# EAGLE design expansion-dualdrive (EAGLE 9.6.2)
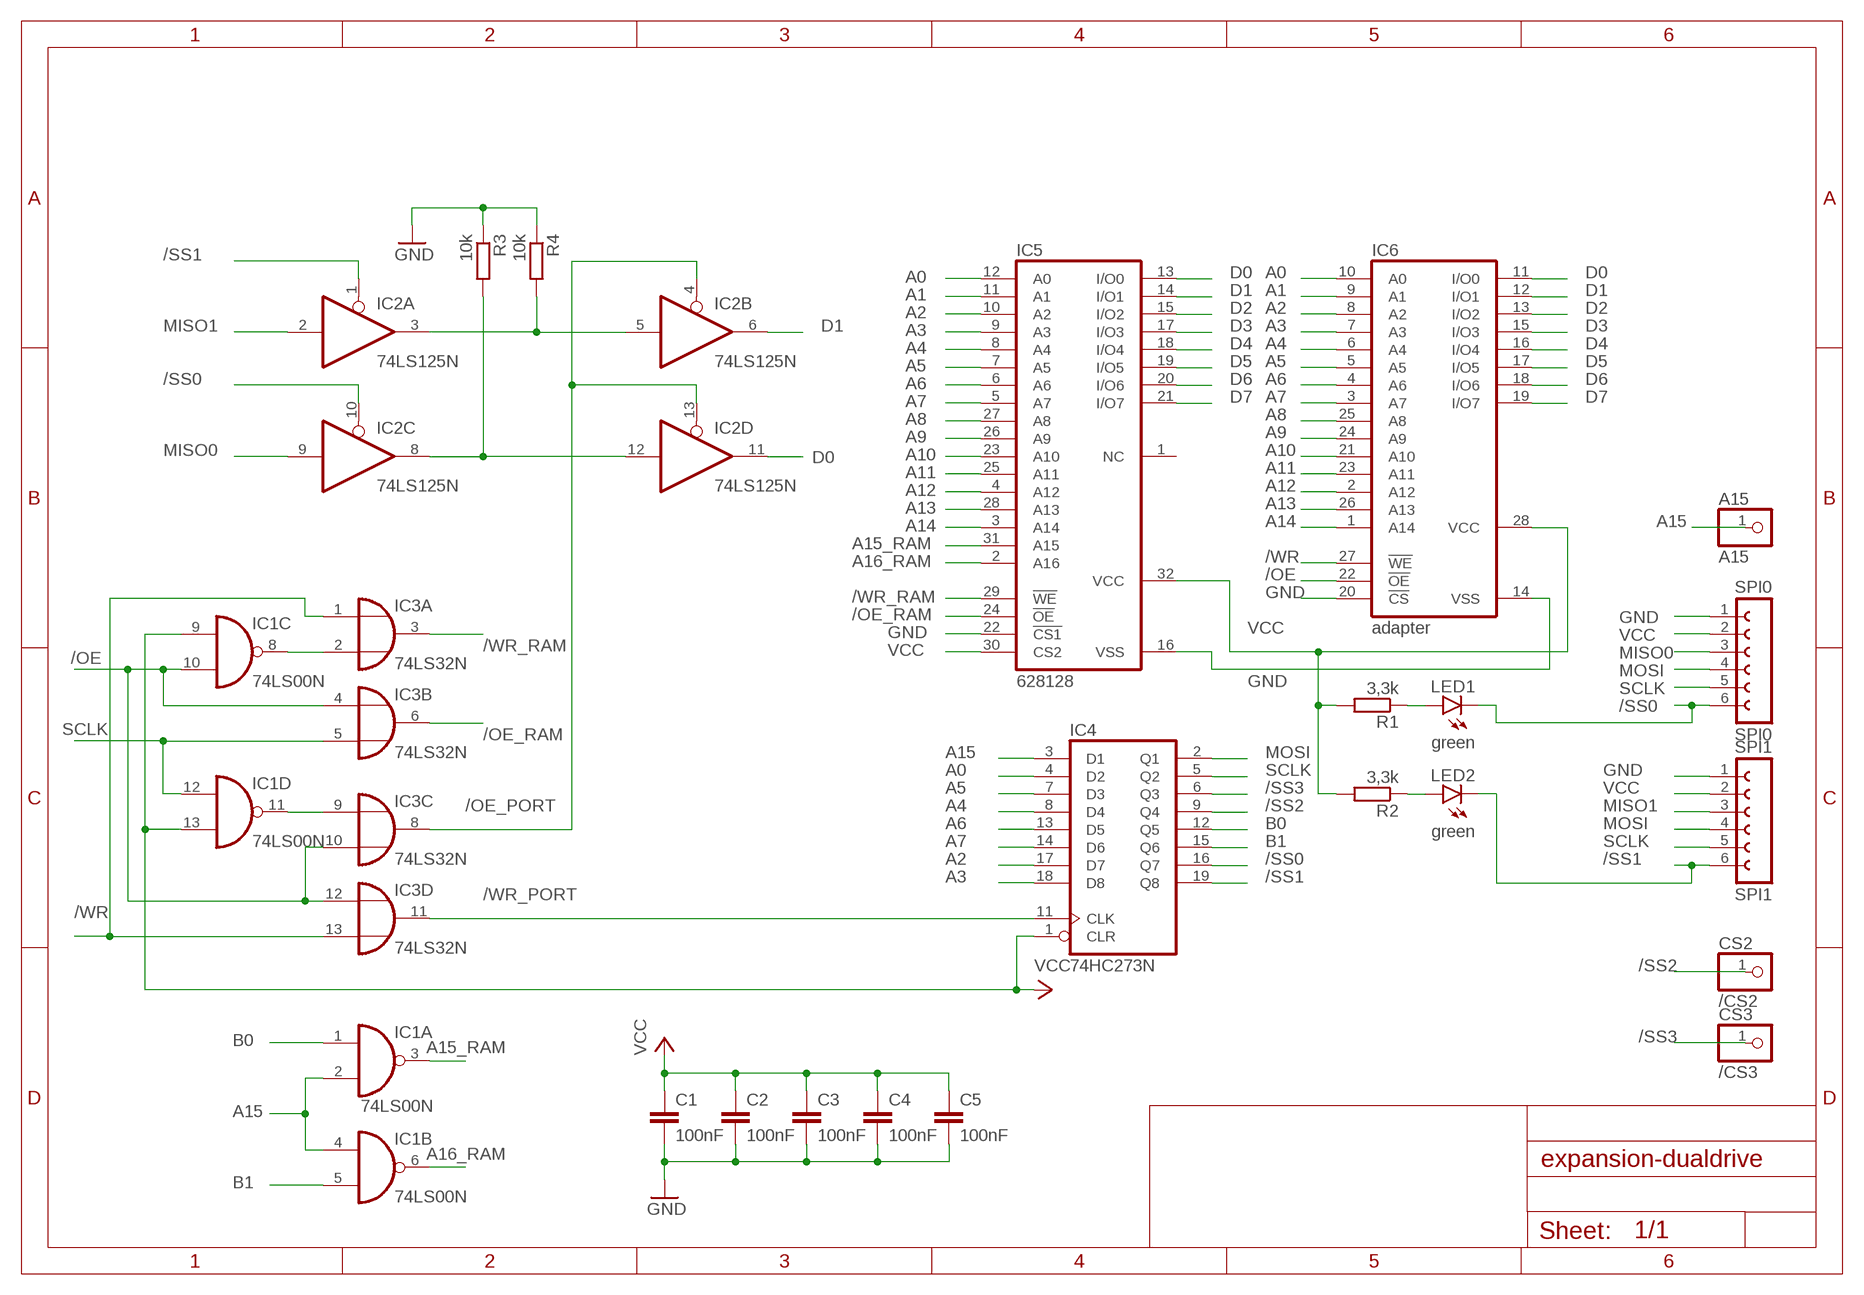
[diagram p0: schematic, sheet 1]

## Parts
A15  A15  PINHD-1X1  [1X01]
C1  100nF  C-EU050-024X044  [C050-024X044]
C2  100nF  C-EU050-024X044  [C050-024X044]
C3  100nF  C-EU050-024X044  [C050-024X044]
C4  100nF  C-EU050-024X044  [C050-024X044]
C5  100nF  C-EU050-024X044  [C050-024X044]
CS2  /CS2  PINHD-1X1  [1X01]
CS3  /CS3  PINHD-1X1  [1X01]
IC1  74LS00N  [DIL14]
IC2  74LS125N  [DIL14]
IC3  74LS32N  [DIL14]
IC4  74HC273N  [DIL20]
IC5  628128  628128P  [DIL32]
IC6  adapter  62256P  [DIL28-6]
LED1  green  LED3MM  [LED3MM]
LED2  green  LED3MM  [LED3MM]
R1  3,3k  R-EU_0207/10  [0207/10]
R2  3,3k  R-EU_0207/10  [0207/10]
R3  10k  R-EU_0207/10  [0207/10]
R4  10k  R-EU_0207/10  [0207/10]
SPI0  SPI0  FE06-1  [FE06]
SPI1  SPI1  FE06-1  [FE06]

## Nets
/OE: IC1.10(C:I1) IC3.4(B:I0) IC3.10(C:I1) IC3.12(D:I0) IC6.22(!OE)
/OE_PORT: IC2.4(B:OE) IC2.13(D:OE) IC3.8(C:O)
/OE_RAM: IC3.6(B:O) IC5.24(!OE)
/SS0: IC2.10(C:OE) IC4.16(Q7) LED1.K(C) SPI0.6
/SS1: IC2.1(A:OE) IC4.19(Q8) LED2.K(C) SPI1.6
/SS2: CS2.1 IC4.9(Q4)
/SS3: CS3.1 IC4.6(Q3)
/WR: IC3.1(A:I0) IC3.13(D:I1) IC6.27(!WE)
/WR_PORT: IC3.11(D:O) IC4.11(CLK)
/WR_RAM: IC3.3(A:O) IC5.29(!WE)
A0: IC4.4(D2) IC5.12(A0) IC6.10(A0)
A1: IC5.11(A1) IC6.9(A1)
A2: IC4.17(D7) IC5.10(A2) IC6.8(A2)
A3: IC4.18(D8) IC5.9(A3) IC6.7(A3)
A4: IC4.8(D4) IC5.8(A4) IC6.6(A4)
A5: IC4.7(D3) IC5.7(A5) IC6.5(A5)
A6: IC4.13(D5) IC5.6(A6) IC6.4(A6)
A7: IC4.14(D6) IC5.5(A7) IC6.3(A7)
A8: IC5.27(A8) IC6.25(A8)
A9: IC5.26(A9) IC6.24(A9)
A10: IC5.23(A10) IC6.21(A10)
A11: IC5.25(A11) IC6.23(A11)
A12: IC5.4(A12) IC6.2(A12)
A13: IC5.28(A13) IC6.26(A13)
A14: IC5.3(A14) IC6.1(A14)
A15: A15.1 IC1.2(A:I1) IC1.4(B:I0) IC4.3(D1)
A15_RAM: IC1.3(A:O) IC5.31(A15)
A16_RAM: IC1.6(B:O) IC5.2(A16)
B0: IC1.1(A:I0) IC4.12(Q5)
B1: IC1.5(B:I1) IC4.15(Q6)
D0: IC2.11(D:O) IC5.13(I/O0) IC6.11(I/O0)
D1: IC2.6(B:O) IC5.14(I/O1) IC6.12(I/O1)
D2: IC5.15(I/O2) IC6.13(I/O2)
D3: IC5.17(I/O3) IC6.15(I/O3)
D4: IC5.18(I/O4) IC6.16(I/O4)
D5: IC5.19(I/O5) IC6.17(I/O5)
D6: IC5.20(I/O6) IC6.18(I/O6)
D7: IC5.21(I/O7) IC6.19(I/O7)
GND [power]: C1.2 C2.2 C3.2 C4.2 C5.2 IC5.16(VSS) IC5.22(!CS1) IC6.14(VSS) IC6.20(!CS) R3.1 R4.1 SPI0.1 SPI1.1
MI0: IC2.8(C:O) IC2.12(D:I) R3.2
MI1: IC2.3(A:O) IC2.5(B:I) R4.2
MISO0: IC2.9(C:I) SPI0.3
MISO1: IC2.2(A:I) SPI1.3
MOSI: IC4.2(Q1) SPI0.4 SPI1.4
N$1: IC1.8(C:O) IC3.2(A:I1)
N$2: LED1.A R1.1
N$3: IC1.11(D:O) IC3.9(C:I0)
N$4: LED2.A R2.1
SCLK: IC1.12(D:I0) IC3.5(B:I1) IC4.5(Q2) SPI0.5 SPI1.5
VCC [power]: C1.1 C2.1 C3.1 C4.1 C5.1 IC1.9(C:I0) IC1.13(D:I1) IC4.1(CLR) IC5.30(CS2) IC5.32(VCC) IC6.28(VCC) R1.2 R2.2 SPI0.2 SPI1.2
Unconnected: IC5.1(NC)

## Power pins joined to a net without a drawn wire
GND: IC1.7(P:GND) IC2.7(P:GND) IC3.7(P:GND) IC4.10(GND)
VCC: IC1.14(P:VCC) IC2.14(P:VCC) IC3.14(P:VCC) IC4.20(VCC)

## Library data of the parts
A15 CS2 CS3 = pinhead:PINHD-1X1: PIN HEADER
C1-C5 = rcl:C-EU: CAPACITOR, European symbol; SPICEPREFIX: C
IC1 = 74xx-eu:74*00: Quad 2-input NAND gate
IC2 = 74xx-eu:74*125: Quad bus BUFFER, 3-state
IC3 = 74xx-eu:74*32: Quad 2-input OR gate
IC4 = 74xx-eu:74*273: Octal D type FLIP FLOP, clear
IC5 = memory-hitachi:628128P: MEMORY; OC_FARNELL: unknown; OC_NEWARK: unknown
IC6 = memory-hitachi:62256P: MEMORY; OC_FARNELL: unknown; OC_NEWARK: unknown
LED1 LED2 = led:LED: LED OSRAM: - CHIPLED LG R971, LG N971, LY N971, LG Q971, LY Q971, LO R971, LY R971 LH N974, LH R974 LS Q976, LO Q976, LY Q976 LO Q996 - Hyper CHIPLED LW Q18S LB Q993, LB Q99A, LB R99A - SideLED LS A670, LO A670, LY A670, LG A670, LP A670 LB A673, LV A673, LT A673, LW A673 LH A674 LY A675 LS A676, LA A676, LO A676, LY A676, LW A676 LS A679, LY A679, LG A679 - Hyper Micro SIDELED® LS Y876, LA Y876, LO Y876, LY Y876 LT Y87S - SmartLED LW L88C, LW L88S LB L89C, LB L89S, LG L890 LS L89K, LO L89K, LY L89K LS L896, LA L896, LO L896, LY L896 - TOPLED LS T670, LO T670, LY T670, LG T670, LP T670 LSG T670, LSP T670, LSY T670, LOP T670, LYG T670 LG T671, LOG T671, LSG T671 LB T673, LV T673, LT T673, LW T673 LH T674 LS T676, LA T676, LO T676, LY T676, LB T676, LH T676, LSB T676, LW T676 LB T67C, LV T67C, LT T67C, LS T67K, LO T67K, LY T67K, LW E67C LS E67B, LA E67B, LO E67B, LY E67B, LB E67C, LV E67C, LT E67C LW T67C LS T679, LY T679, LG T679 LS T770, LO T770, LY T770, LG T770, LP T770 LB T773, LV T773, LT T773, LW T773 LH T774 LS E675, LA E675, LY E675, LS T675 LS T776, LA T776, LO T776, LY T776, LB T776 LHGB T686 LT T68C, LB T68C - Hyper Mini TOPLED® LB M676 - Mini TOPLED Santana® LG M470 LS M47K, LO M47K, LY M47K Source: http://www.osram.convergy.de LUXEON: - LUMILED® LXK2-PW12-R00, LXK2-PW12-S00, LXK2-PW14-U00, LXK2-PW14-V00 LXK2-PM12-R00, LXK2-PM12-S00, LXK2-PM14-U00 LXK2-PE12-Q00, LXK2-PE12-R00, LXK2-PE12-S00, LXK2-PE14-T00, LXK2-PE14-U00 LXK2-PB12-K00, LXK2-PB12-L00, LXK2-PB12-M00, LXK2-PB14-N00, LXK2-PB14-P00, LXK2-PB14-Q00 LXK2-PR12-L00, LXK2-PR12-M00, LXK2-PR14-Q00, LXK2-PR14-R00 LXK2-PD12-Q00, LXK2-PD12-R00, LXK2-PD12-S00 LXK2-PH12-R00, LXK2-PH12-S00 LXK2-PL12-P00, LXK2-PL12-Q00, LXK2-PL12-R00 Source: www.luxeon.com KINGBRIGHT: KA-3528ASYC Source: www.kingbright.com
R1-R4 = rcl:R-EU_: RESISTOR, European symbol; SPICEPREFIX: R
SPI0 SPI1 = con-lsta:FE06-1: FEMALE HEADER; OC_FARNELL: unknown; OC_NEWARK: unknown

## Net classes
0 default: width 0.305 mm
1 power: width 0.508 mm, clearance 0.203 mm

## Board
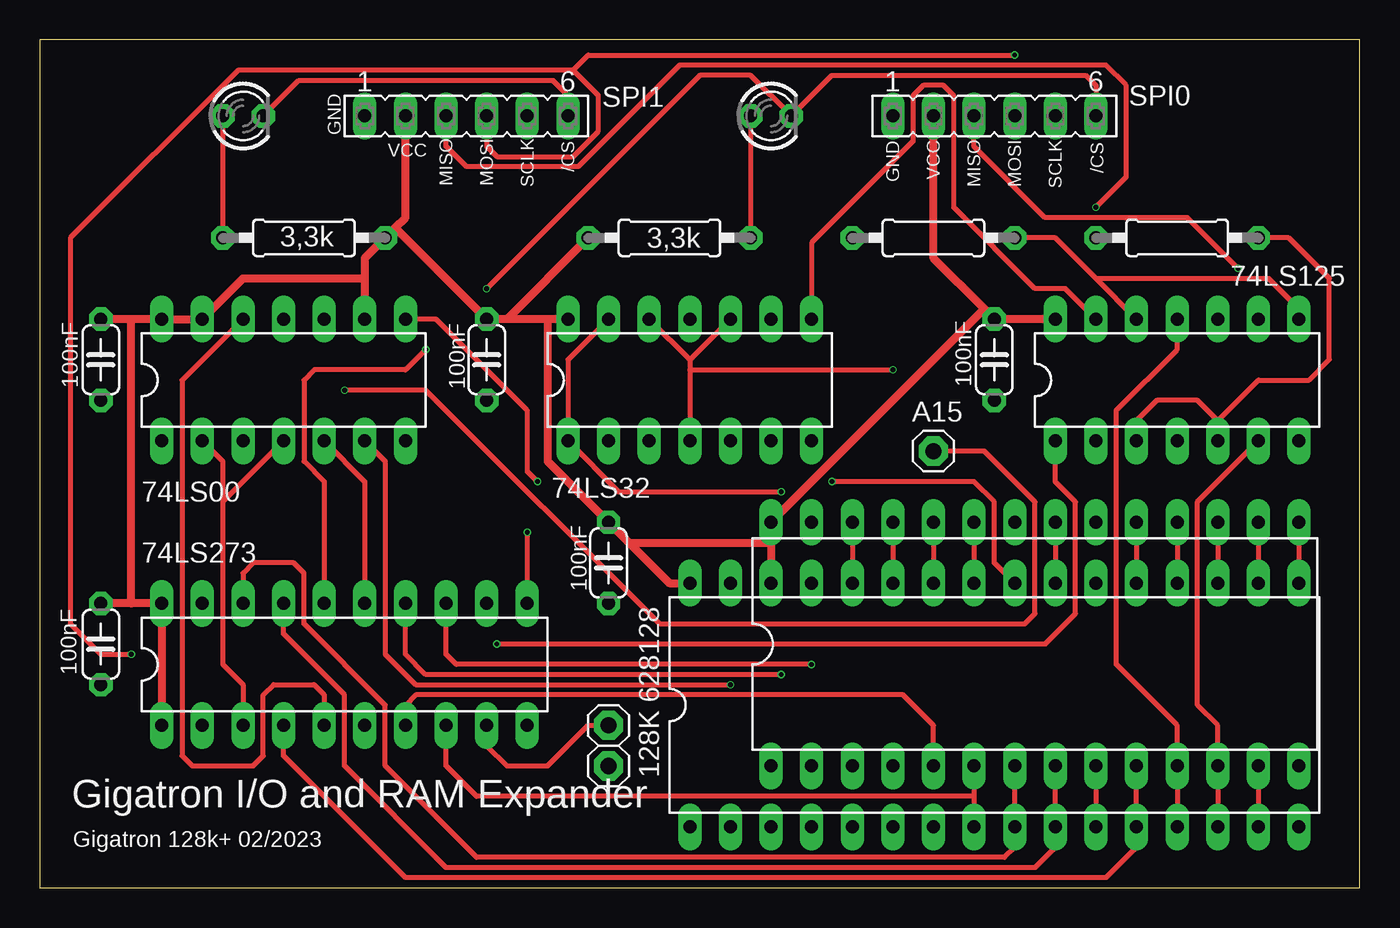
[diagram p1: board, top side]
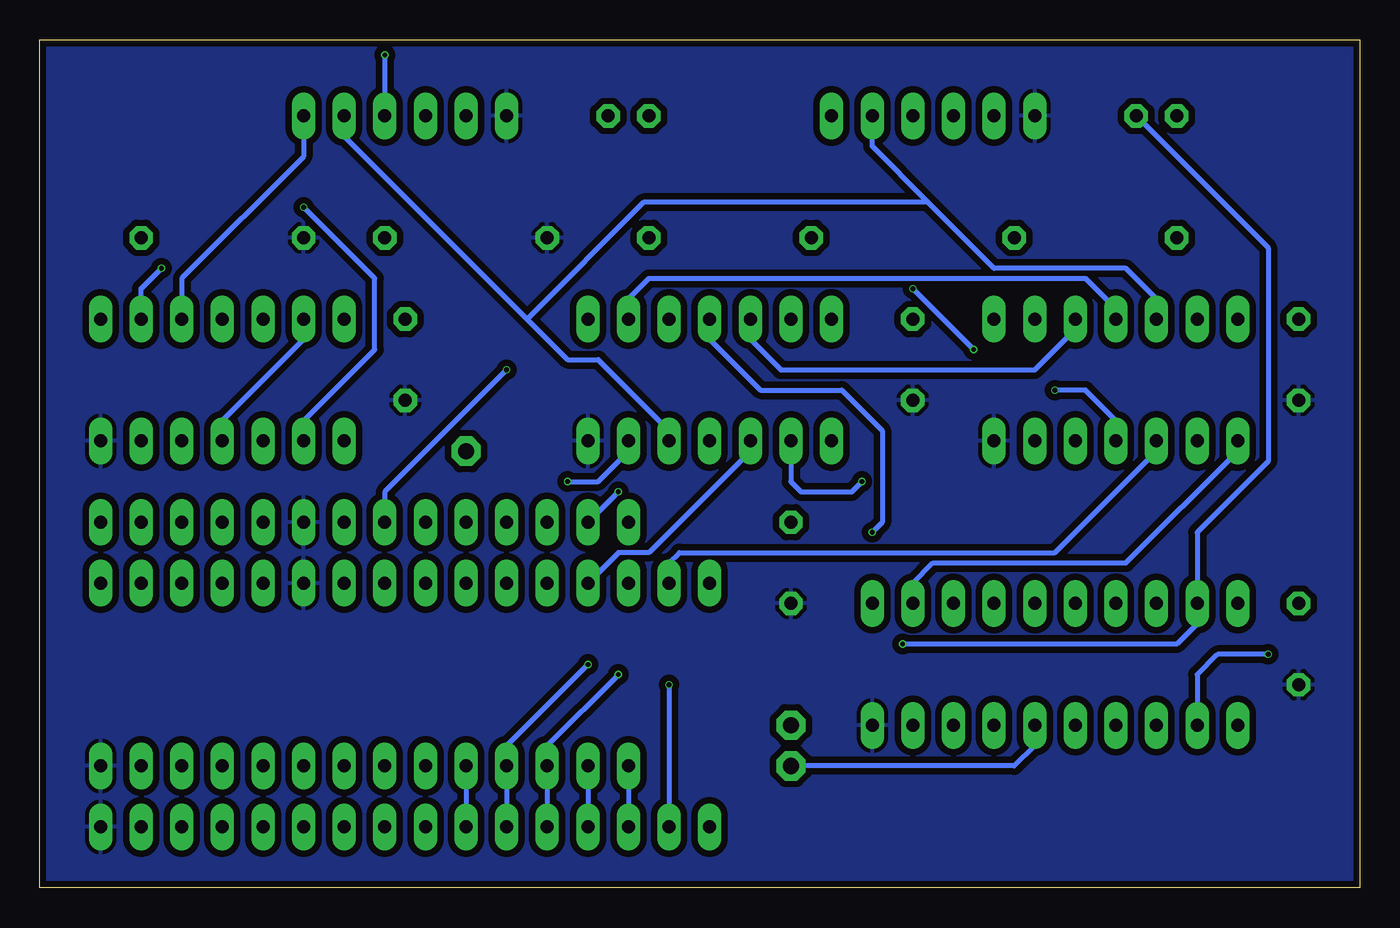
[diagram p2: board, bottom side, seen from below]

Size 82.53 x 53.01 mm. Coordinates in mm from the lower left corner, seen from the top.
Outline: 0,0 82.53,0 82.53,53.01 0,53.01 0,0
Copper layers (1*16): Top 0.035mm / dielectric 1.6mm / Bottom 0.035mm
Design rules "jlcpcb-2layers *": minimum track width 12mil, minimum drill 0.3mm, track to track 8mil, track to pad 8mil, pad to pad 8mil, via to via 8mil, smd to smd 5mil, copper to edge 0.2mm, drill to drill 6mil, minimum pad ring 10mil, minimum via ring 3mil, stop-mask expansion 4mil, vias tented up to drill 0mil, thermal gap 10mil

### Footprints (pad centres in the part's own frame; a part is rotated, then mirrored left to right if it is on the bottom)
1X01 = drill 1.016 octagon: 1 0,0
C050-024X044 = drill 0.813 octagon: 1 -2.54,0; 2 2.54,0
DIL14 = drill 0.813 long: 1 -7.62,-3.81; 2 -5.08,-3.81; 3 -2.54,-3.81; 4 0,-3.81; 5 2.54,-3.81; 6 5.08,-3.81; 7 7.62,-3.81; 8 7.62,3.81; 9 5.08,3.81; 10 2.54,3.81; 11 0,3.81; 12 -2.54,3.81; 13 -5.08,3.81; 14 -7.62,3.81
DIL20 = drill 0.813 long: 1 -11.43,-3.81; 2 -8.89,-3.81; 3 -6.35,-3.81; 4 -3.81,-3.81; 5 -1.27,-3.81; 6 1.27,-3.81; 7 3.81,-3.81; 8 6.35,-3.81; 9 8.89,-3.81; 10 11.43,-3.81; 11 11.43,3.81; 12 8.89,3.81; 13 6.35,3.81; 14 3.81,3.81; 15 1.27,3.81; 16 -1.27,3.81; 17 -3.81,3.81; 18 -6.35,3.81; 19 -8.89,3.81; 20 -11.43,3.81
DIL32 = drill 0.813 long: 1 -19.05,-7.62; 2 -16.51,-7.62; 3 -13.97,-7.62; 4 -11.43,-7.62; 5 -8.89,-7.62; 6 -6.35,-7.62; 7 -3.81,-7.62; 8 -1.27,-7.62; 9 1.27,-7.62; 10 3.81,-7.62; 11 6.35,-7.62; 12 8.89,-7.62; 13 11.43,-7.62; 14 13.97,-7.62; 15 16.51,-7.62; 16 19.05,-7.62; 17 19.05,7.62; 18 16.51,7.62; 19 13.97,7.62; 20 11.43,7.62; 21 8.89,7.62; 22 6.35,7.62; 23 3.81,7.62; 24 1.27,7.62; 25 -1.27,7.62; 26 -3.81,7.62; 27 -6.35,7.62; 28 -8.89,7.62; 29 -11.43,7.62; 30 -13.97,7.62; 31 -16.51,7.62; 32 -19.05,7.62
DIL28-6 = drill 0.813 long: 1 -16.51,-7.62; 2 -13.97,-7.62; 3 -11.43,-7.62; 4 -8.89,-7.62; 5 -6.35,-7.62; 6 -3.81,-7.62; 7 -1.27,-7.62; 8 1.27,-7.62; 9 3.81,-7.62; 10 6.35,-7.62; 11 8.89,-7.62; 12 11.43,-7.62; 13 13.97,-7.62; 14 16.51,-7.62; 15 16.51,7.62; 16 13.97,7.62; 17 11.43,7.62; 18 8.89,7.62; 19 6.35,7.62; 20 3.81,7.62; 21 1.27,7.62; 22 -1.27,7.62; 23 -3.81,7.62; 24 -6.35,7.62; 25 -8.89,7.62; 26 -11.43,7.62; 27 -13.97,7.62; 28 -16.51,7.62
LED3MM = drill 0.813 octagon: A -1.27,0; K 1.27,0
0207/10 = drill 0.813 octagon: 1 -5.08,0; 2 5.08,0
FE06 = drill 0.813 long: 1 -6.35,0; 2 -3.81,0; 3 -1.27,0; 4 1.27,0; 5 3.81,0; 6 6.35,0

### Placement (x,y rotation side)
A15  55.88,27.3 0 top
C1  3.81,15.24 270 top
C2  3.81,33.02 270 top
C3  27.94,33.02 270 top
C4  59.69,33.02 270 top
C5  35.56,20.32 270 top
CS2  35.56,10.16 0 top
CS3  35.56,7.62 0 top
IC1  15.24,31.75 0 top
IC2  71.12,31.75 0 top
IC3  40.64,31.75 0 top
IC4  19.05,13.97 0 top
IC5  59.69,11.43 0 top
IC6  62.23,15.24 0 top
LED1  45.72,48.26 0 top
LED2  12.7,48.26 0 top
R1  39.37,40.64 180 top
R2  16.51,40.64 0 top
R3  55.88,40.64 0 top
R4  71.12,40.64 0 top
SPI0  59.69,48.26 0 top
SPI1  26.67,48.26 0 top

### Tracks (layer width: path | path; a pad name or v marks a point on that pad's centre or on a via)
/OE  (via drill 0.3)
  Top 0.305: 40.64,33.02 40.64,32.38 | 40.64,32.38 IC3.4 | IC3.12 40.64,33.02 | 40.64,33.02 IC3.10 | 40.64,32.38 v53.34,32.38
  Bottom 0.305: IC1.10 17.78,34.92 20.32,32.38 36.2,32.38 38.1,34.29 IC3.12 | IC6.22 60.96,24.77 v53.34,32.38
/OE_PORT
  Top 0.305: IC3.8 48.26,40.32 54.61,46.67 54.61,49.53 55.24,50.16 56.52,50.16 57.15,49.53 57.15,42.55 62.23,37.47 64.14,37.47 IC2.13
  Bottom 0.305: IC2.4 71.12,29.21 66.04,34.29 IC2.13
/OE_RAM  (via drill 0.3)
  Top 0.305: v49.53,25.4 58.42,25.4 59.69,24.13 59.69,20.32 IC5.24
  Bottom 0.305: IC3.6 45.72,27.3 47.62,25.4 v49.53,25.4
/SS0  (via drill 0.3)
  Top 0.305: IC4.16 17.78,25.4 16.51,26.67 16.51,31.75 17.14,32.38 22.86,32.38 v24.13,33.66 | v27.94,37.47 41.27,50.8 44.45,50.8 LED1.K 49.53,50.8 65.41,50.8 66.04,50.16 SPI0.6
  Bottom 0.305: v27.94,37.47 v24.13,33.66 | IC2.10 73.66,38.1 66.04,45.72 SPI0.6
/SS1  (via drill 0.3)
  Top 0.305: SPI1.6 33.02,49.53 32.07,50.48 16.19,50.48 LED2.K | IC2.1 63.5,25.4 64.77,24.13 64.77,17.14 62.87,15.24 v28.57,15.24
  Bottom 0.305: LED2.K 5.71,40.01 5.71,26.67 10.16,22.23 IC4.19 10.16,16.51 11.43,15.24 v28.57,15.24
/SS2
  Top 0.305: IC4.9 27.94,8.89 29.21,7.62 31.75,7.62 34.29,10.16 CS2.1
/SS3
  Bottom 0.305: IC4.6 20.32,8.89 21.59,7.62 CS3.1
/WR  (via drill 0.3)
  Top 0.305: IC3.13 33.02,33.02 IC3.1 36.2,24.77 v46.35,24.77
  Bottom 0.305: v46.35,24.77 IC6.27
/WR_PORT  (via drill 0.3)
  Top 0.305: v30.48,22.23 IC4.11
  Bottom 0.305: v30.48,22.23 29.84,22.86 29.84,28.57 32.38,31.11 37.47,31.11 40.64,34.29 IC3.11
/WR_RAM
  Bottom 0.305: IC5.29 46.35,20.95 44.45,20.95 38.1,27.3 IC3.3
A0
  Top 0.305: IC4.4 15.24,8.26 22.86,0.64 66.67,0.64 68.58,2.54 IC5.12 IC6.10
A1
  Top 0.305: IC6.9 IC5.11
A2
  Top 0.305: IC4.17 15.24,15.88 19.05,12.06 19.05,7.62 25.4,1.27 62.23,1.27 63.5,2.54 IC5.10 IC6.8
A3
  Top 0.305: IC4.18 12.7,19.68 13.34,20.32 15.88,20.32 16.51,19.68 16.51,16.51 21.59,11.43 21.59,7.62 27.3,1.91 60.33,1.91 60.96,2.54 IC5.9 IC6.7
A4
  Top 0.305: IC4.8 25.4,7.62 27.3,5.71 58.42,5.71 | IC6.6 58.42,5.71 | 58.42,5.71 IC5.8
A5
  Top 0.305: IC4.7 22.86,11.43 23.5,12.06 53.98,12.06 55.88,10.16 IC6.5
  Bottom 0.305: IC6.5 IC5.7
A6  (via drill 0.3)
  Top 0.305: IC4.13 25.4,14.61 26.04,13.97 v48.26,13.97
  Bottom 0.305: v48.26,13.97 53.34,8.89 IC6.4 IC5.6
A7  (via drill 0.3)
  Top 0.305: IC4.14 22.86,14.61 24.13,13.34 v46.35,13.34
  Bottom 0.305: v46.35,13.34 50.8,8.89 IC6.3 IC5.5
A8
  Top 0.305: IC6.25 IC5.27
A9
  Top 0.305: IC6.24 IC5.26
A10
  Top 0.305: IC6.21 IC5.23
A11
  Top 0.305: IC6.23 IC5.25
A12
  Bottom 0.305: IC6.2 IC5.4
A13
  Top 0.305: IC6.26 IC5.28
A14
  Bottom 0.305: IC6.1 IC5.3
A15  (via drill 0.3)
  Top 0.305: IC4.3 12.7,12.7 11.43,13.97 11.43,24.13 | 11.43,24.13 11.43,26.67 IC1.2 | 11.43,24.13 IC1.4 | A15.1 59.05,27.3 62.23,24.13 62.23,17.14 61.59,16.51 38.73,16.51 24.13,31.11 v19.05,31.11
  Bottom 0.305: v19.05,31.11 17.14,31.11 15.24,29.21 IC1.4
A15_RAM
  Bottom 0.305: IC1.3 12.7,27.3 19.05,20.95 42.55,20.95 43.18,20.32 IC5.31
A16_RAM  (via drill 0.3)
  Top 0.305: v43.18,12.7 23.5,12.7 21.59,14.61 21.59,26.67 IC1.6
  Bottom 0.305: v43.18,12.7 IC5.2
B0
  Bottom 0.305: IC1.1 7.62,27.3 14.61,20.32 26.67,20.32 27.94,19.05 IC4.12
B1
  Top 0.305: IC4.15 20.32,25.4 IC1.5
D0
  Top 0.305: IC5.13 IC6.11 71.12,10.16 67.31,13.97 67.31,29.84 71.12,33.66 IC2.11
D1
  Top 0.305: IC5.14 IC6.12 73.66,10.16 72.39,11.43 72.39,24.13 IC2.6
D2
  Top 0.305: IC6.13 IC5.15
D3
  Top 0.305: IC6.15 IC5.17
D4
  Top 0.305: IC6.16 IC5.18
D5
  Top 0.305: IC6.17 IC5.19
D6
  Top 0.305: IC6.18 IC5.20
D7
  Top 0.305: IC6.19 IC5.21
GND
  pour Bottom (isolate 0.406): 0,53.34 0,0 82.55,0 82.55,53.34
MI0
  Top 0.305: R3.2 63.5,40.64 66.04,38.1 | IC2.12 66.04,38.1 | IC2.8 78.74,36.2 76.83,38.1 66.04,38.1
MI1
  Top 0.305: IC2.3 68.58,29.21 69.85,30.48 72.39,30.48 73.66,29.21 | R4.2 78.11,40.64 80.64,38.1 80.64,33.02 79.38,31.75 76.2,31.75 73.66,29.21 | IC2.5 73.66,29.21
MISO0  (via drill 0.3)
  Top 0.305: v74.93,38.73 71.75,41.91 62.87,41.91 58.42,46.35 SPI0.3
  Bottom 0.305: v74.93,38.73 76.2,37.47 IC2.9
MISO1  (via drill 0.3)
  Top 0.305: SPI1.3 25.4,46.35 26.67,45.09 33.66,45.09 40.01,51.44 66.67,51.44 67.94,50.16 67.94,44.45 v66.04,42.55
  Bottom 0.305: v66.04,42.55 61.59,38.1 61.59,33.66 66.04,29.21 IC2.2
MOSI  (via drill 0.3)
  Top 0.305: v5.71,14.61 3.81,14.61 1.91,16.51 1.91,40.64 12.38,51.12 33.34,51.12 | 33.34,51.12 34.92,49.53 34.92,47.31 33.34,45.72 28.57,45.72 27.94,46.35 SPI1.4 | v60.96,52.07 34.29,52.07 33.34,51.12
  Bottom 0.305: IC4.2 10.16,13.34 8.89,14.61 v5.71,14.61 | v60.96,52.07 SPI0.4
N$1  (via drill 0.3)
  Top 0.305: IC1.8 24.77,35.56 30.48,29.84 30.48,26.04 v31.11,25.4
  Bottom 0.305: v31.11,25.4 31.75,24.77 34.92,24.77 35.56,25.4 IC3.2
N$2
  Top 0.305: LED1.A R1.1
N$3
  Bottom 0.305: IC1.11 15.24,36.2 17.14,38.1 44.45,38.1 45.72,36.83 IC3.9
N$4
  Top 0.305: LED2.A R2.1
SCLK
  Top 0.305: IC4.5 17.78,12.06 17.14,12.7 14.61,12.7 13.97,12.06 13.97,8.26 13.34,7.62 9.53,7.62 8.89,8.26 8.89,31.75 IC1.12
  Bottom 0.305: IC3.5 43.18,28.57 47.62,33.02 49.53,33.02 52.07,35.56 | 52.07,35.56 63.5,46.99 SPI0.5 | SPI1.5 30.48,46.35 26.99,42.86 | 26.99,42.86 22.86,38.73 14.61,38.73 12.7,36.83 IC1.12 | 52.07,35.56 44.77,42.86 26.99,42.86
VCC
  Top 0.508: 45.72,21.59 IC5.30 | IC5.32 39.37,19.05 36.83,21.59 | 36.83,21.59 C5.1 31.75,26.67 31.75,35.56 | 36.83,21.59 45.72,21.59 | 45.72,21.59 IC6.28 59.05,36.2 | IC2.14 C4.1 59.05,36.2 | SPI0.2 55.88,39.37 59.05,36.2 | IC3.14 31.75,35.56 | 31.75,35.56 29.21,35.56 | 29.21,35.56 C3.1 22.23,41.27 | 29.21,35.56 R1.2 | 20.32,38.1 20.32,39.37 R2.2 22.23,41.27 | 20.32,38.1 IC1.9 | SPI1.2 22.86,41.91 22.23,41.27 | 5.71,35.56 IC1.14 IC1.13 12.7,38.1 20.32,38.1 | 5.71,35.56 C2.1 | 5.71,17.78 IC4.20 IC4.1 | 5.71,17.78 C1.1 | 5.71,17.78 5.71,35.56

### Text on the board
tPlace: SPI1 | SPI0 | GND | VCC | /CS | /CS | MISO | MOSI | SCLK | GND | VCC | MISO | MOSI | SCLK | 3,3k | 3,3k | 74LS125 | 100nF | 100nF | 100nF | 74LS00 | 74LS32 | 74LS273 | 100nF | 100nF | 128K 628128 | Gigatron I/O and RAM Expander | Gigatron 128k+ 02/2023